# EAGLE schematic pcie-host (EAGLE 8.3.2)
DESIGNER: JON NEWMAN, JACK ZHANG; DESIGN_NAME: PCIE HOST BOARD; LICENSE: CC-BY-SA-4.0; REVISION: 1.1
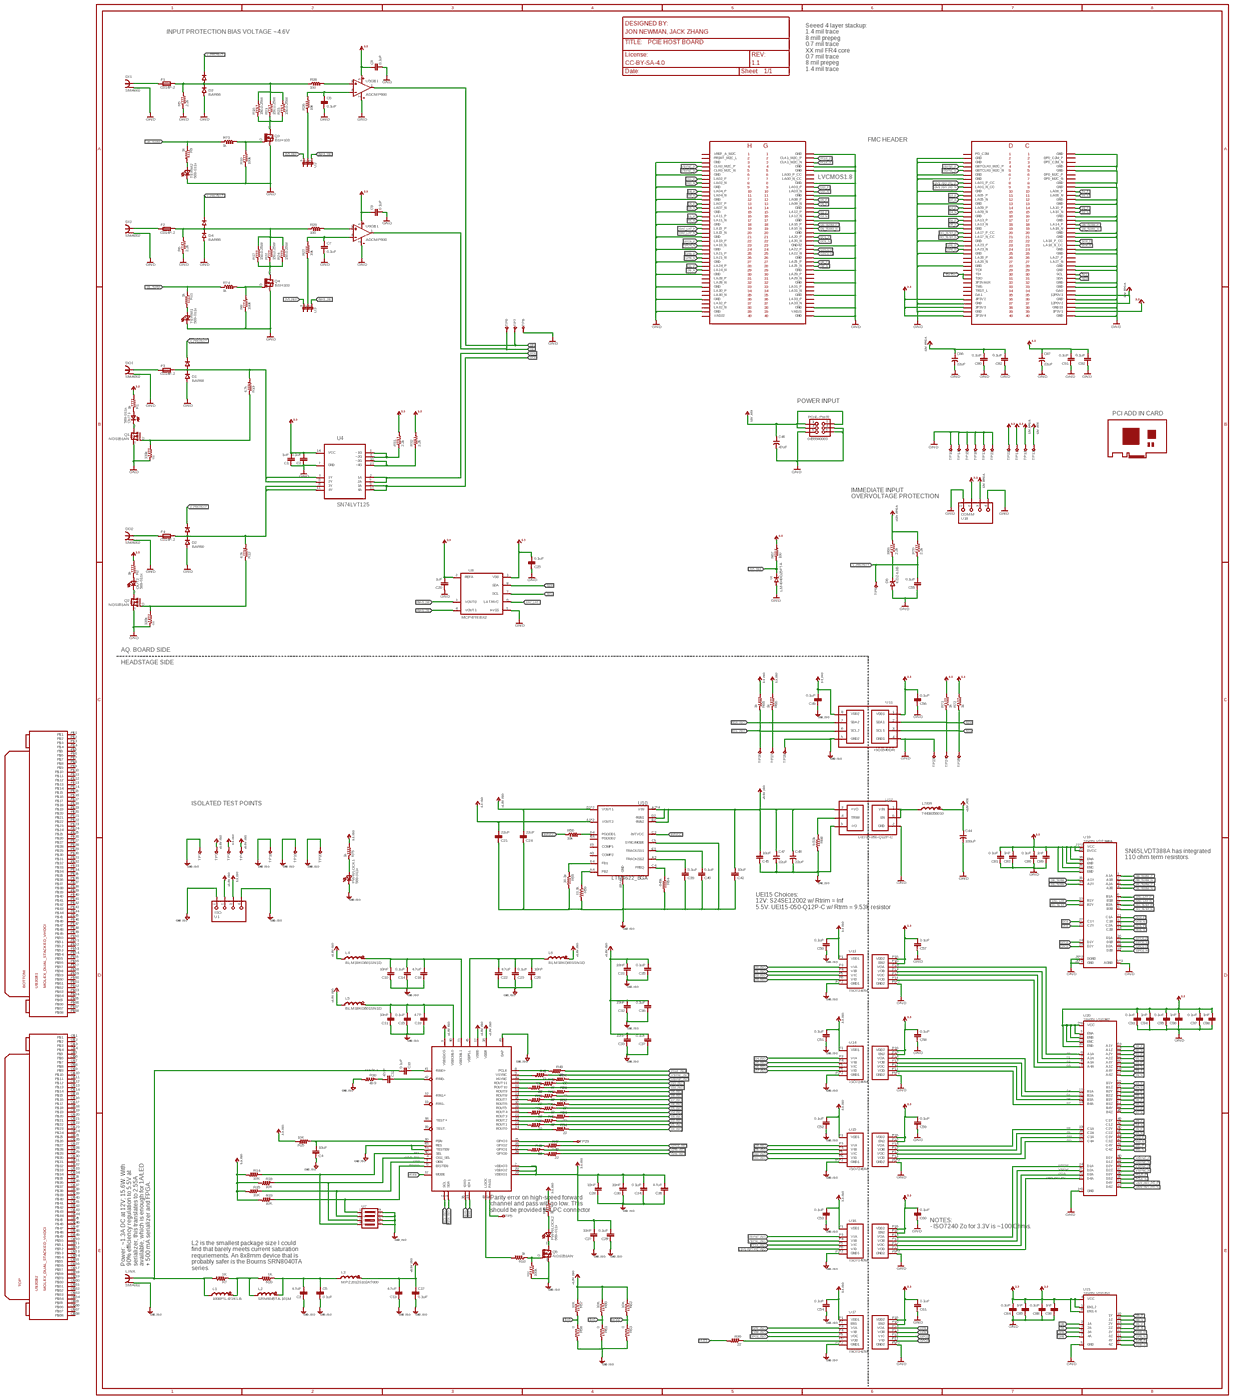
[diagram p0: schematic, sheet 1, overview]
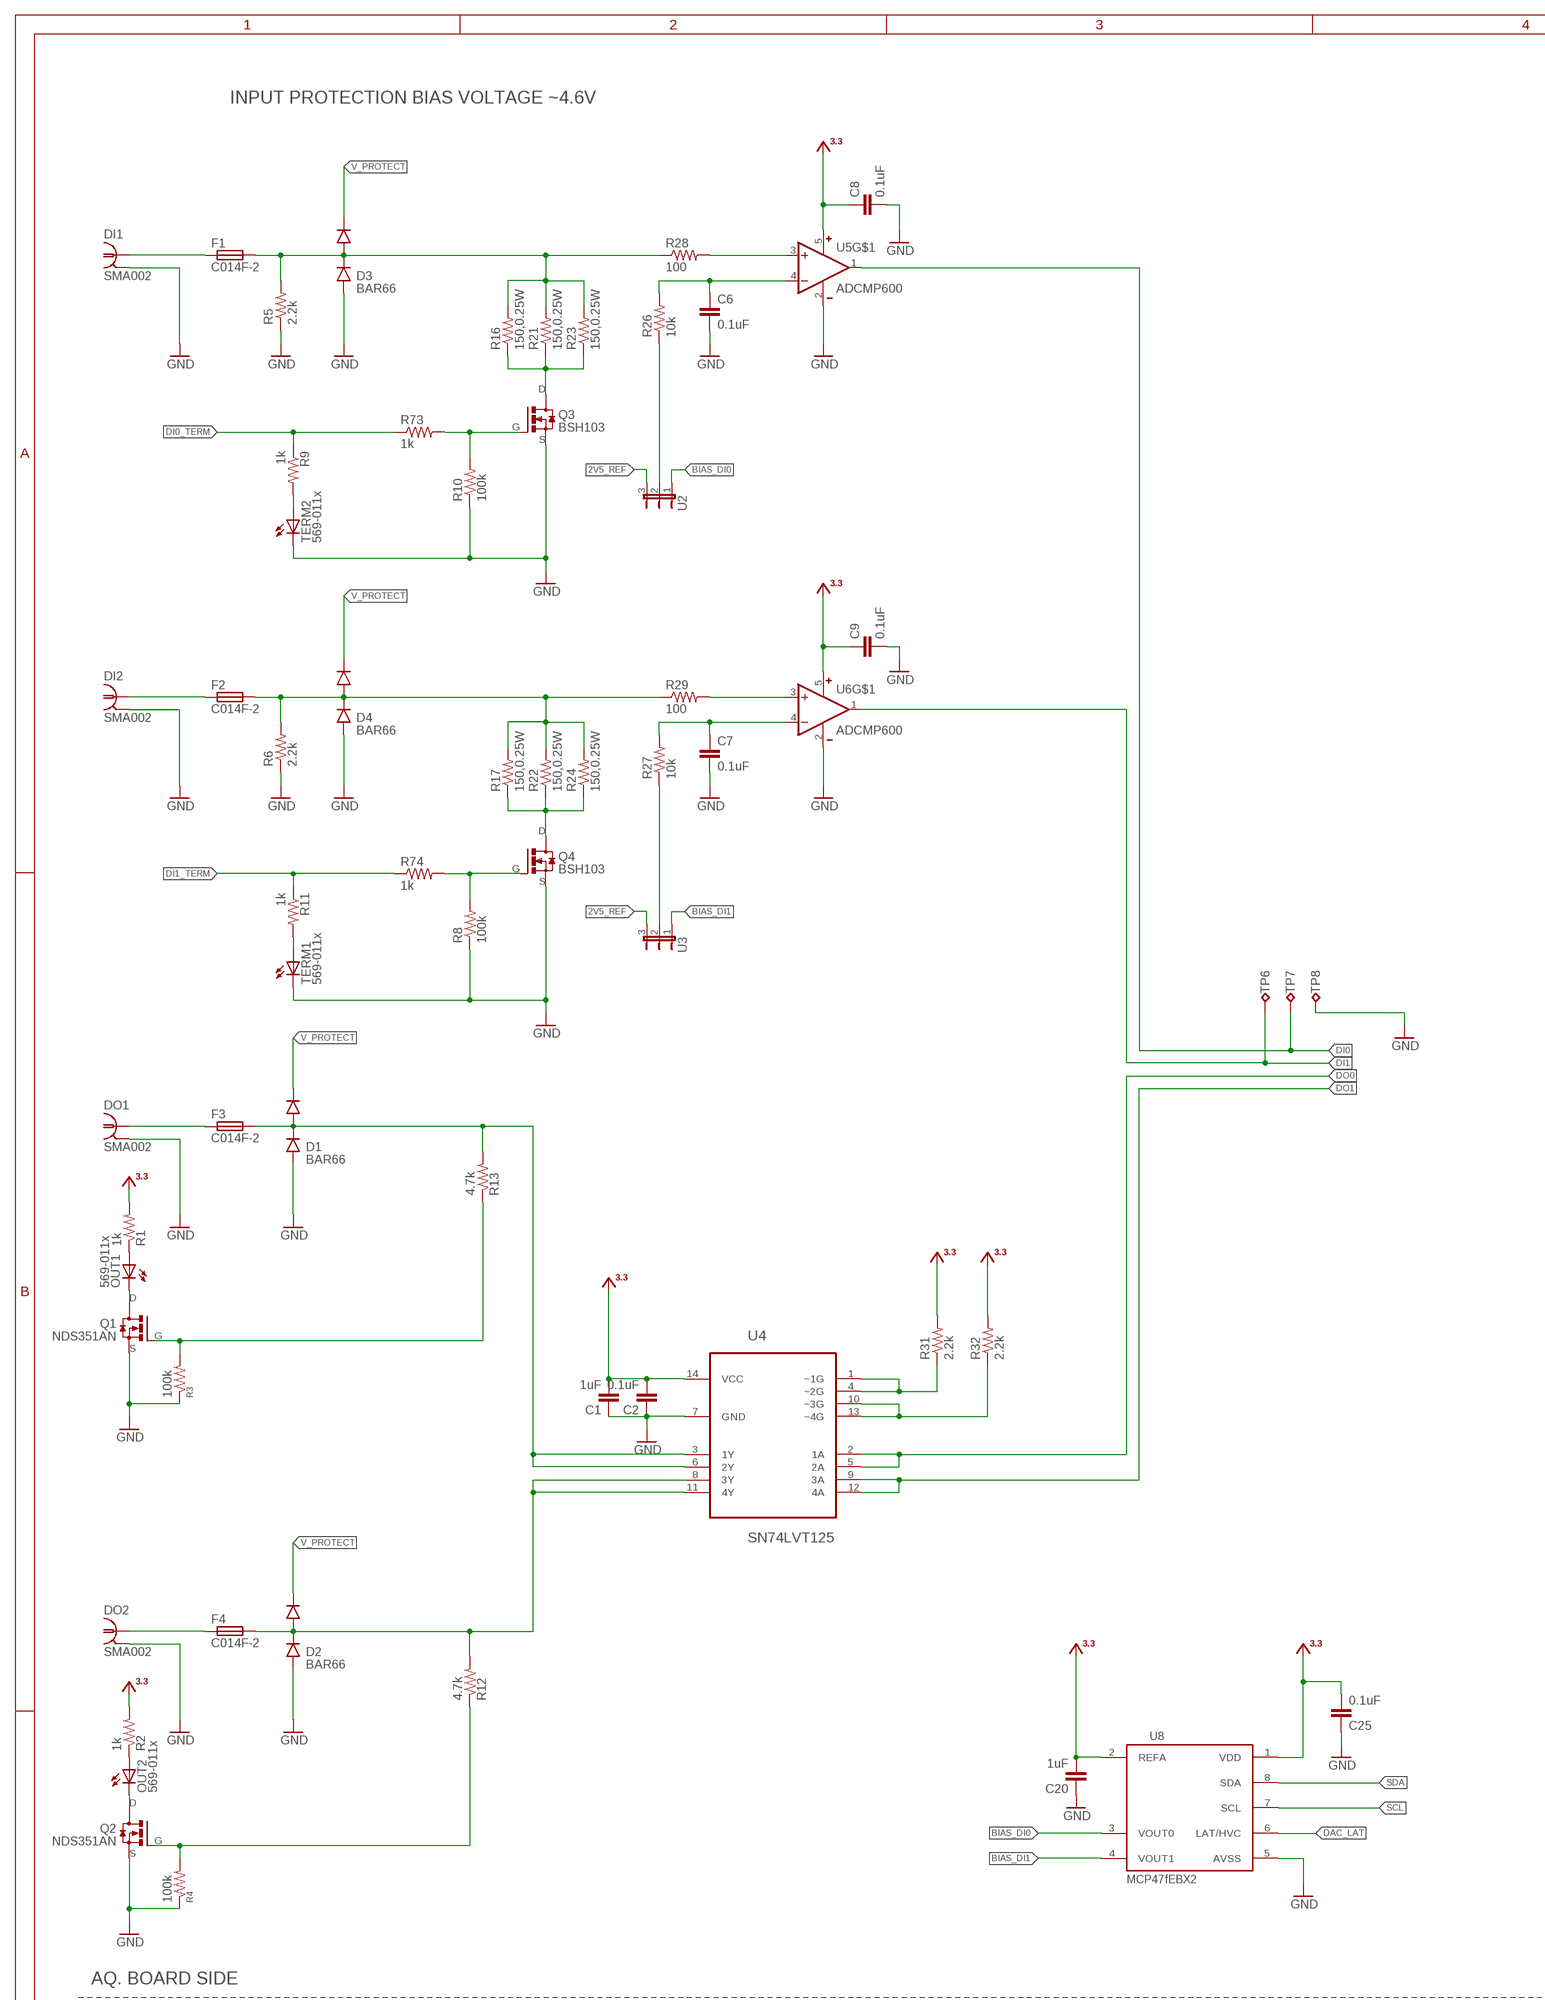
[diagram p1: schematic, sheet 1, part 1 of 4]
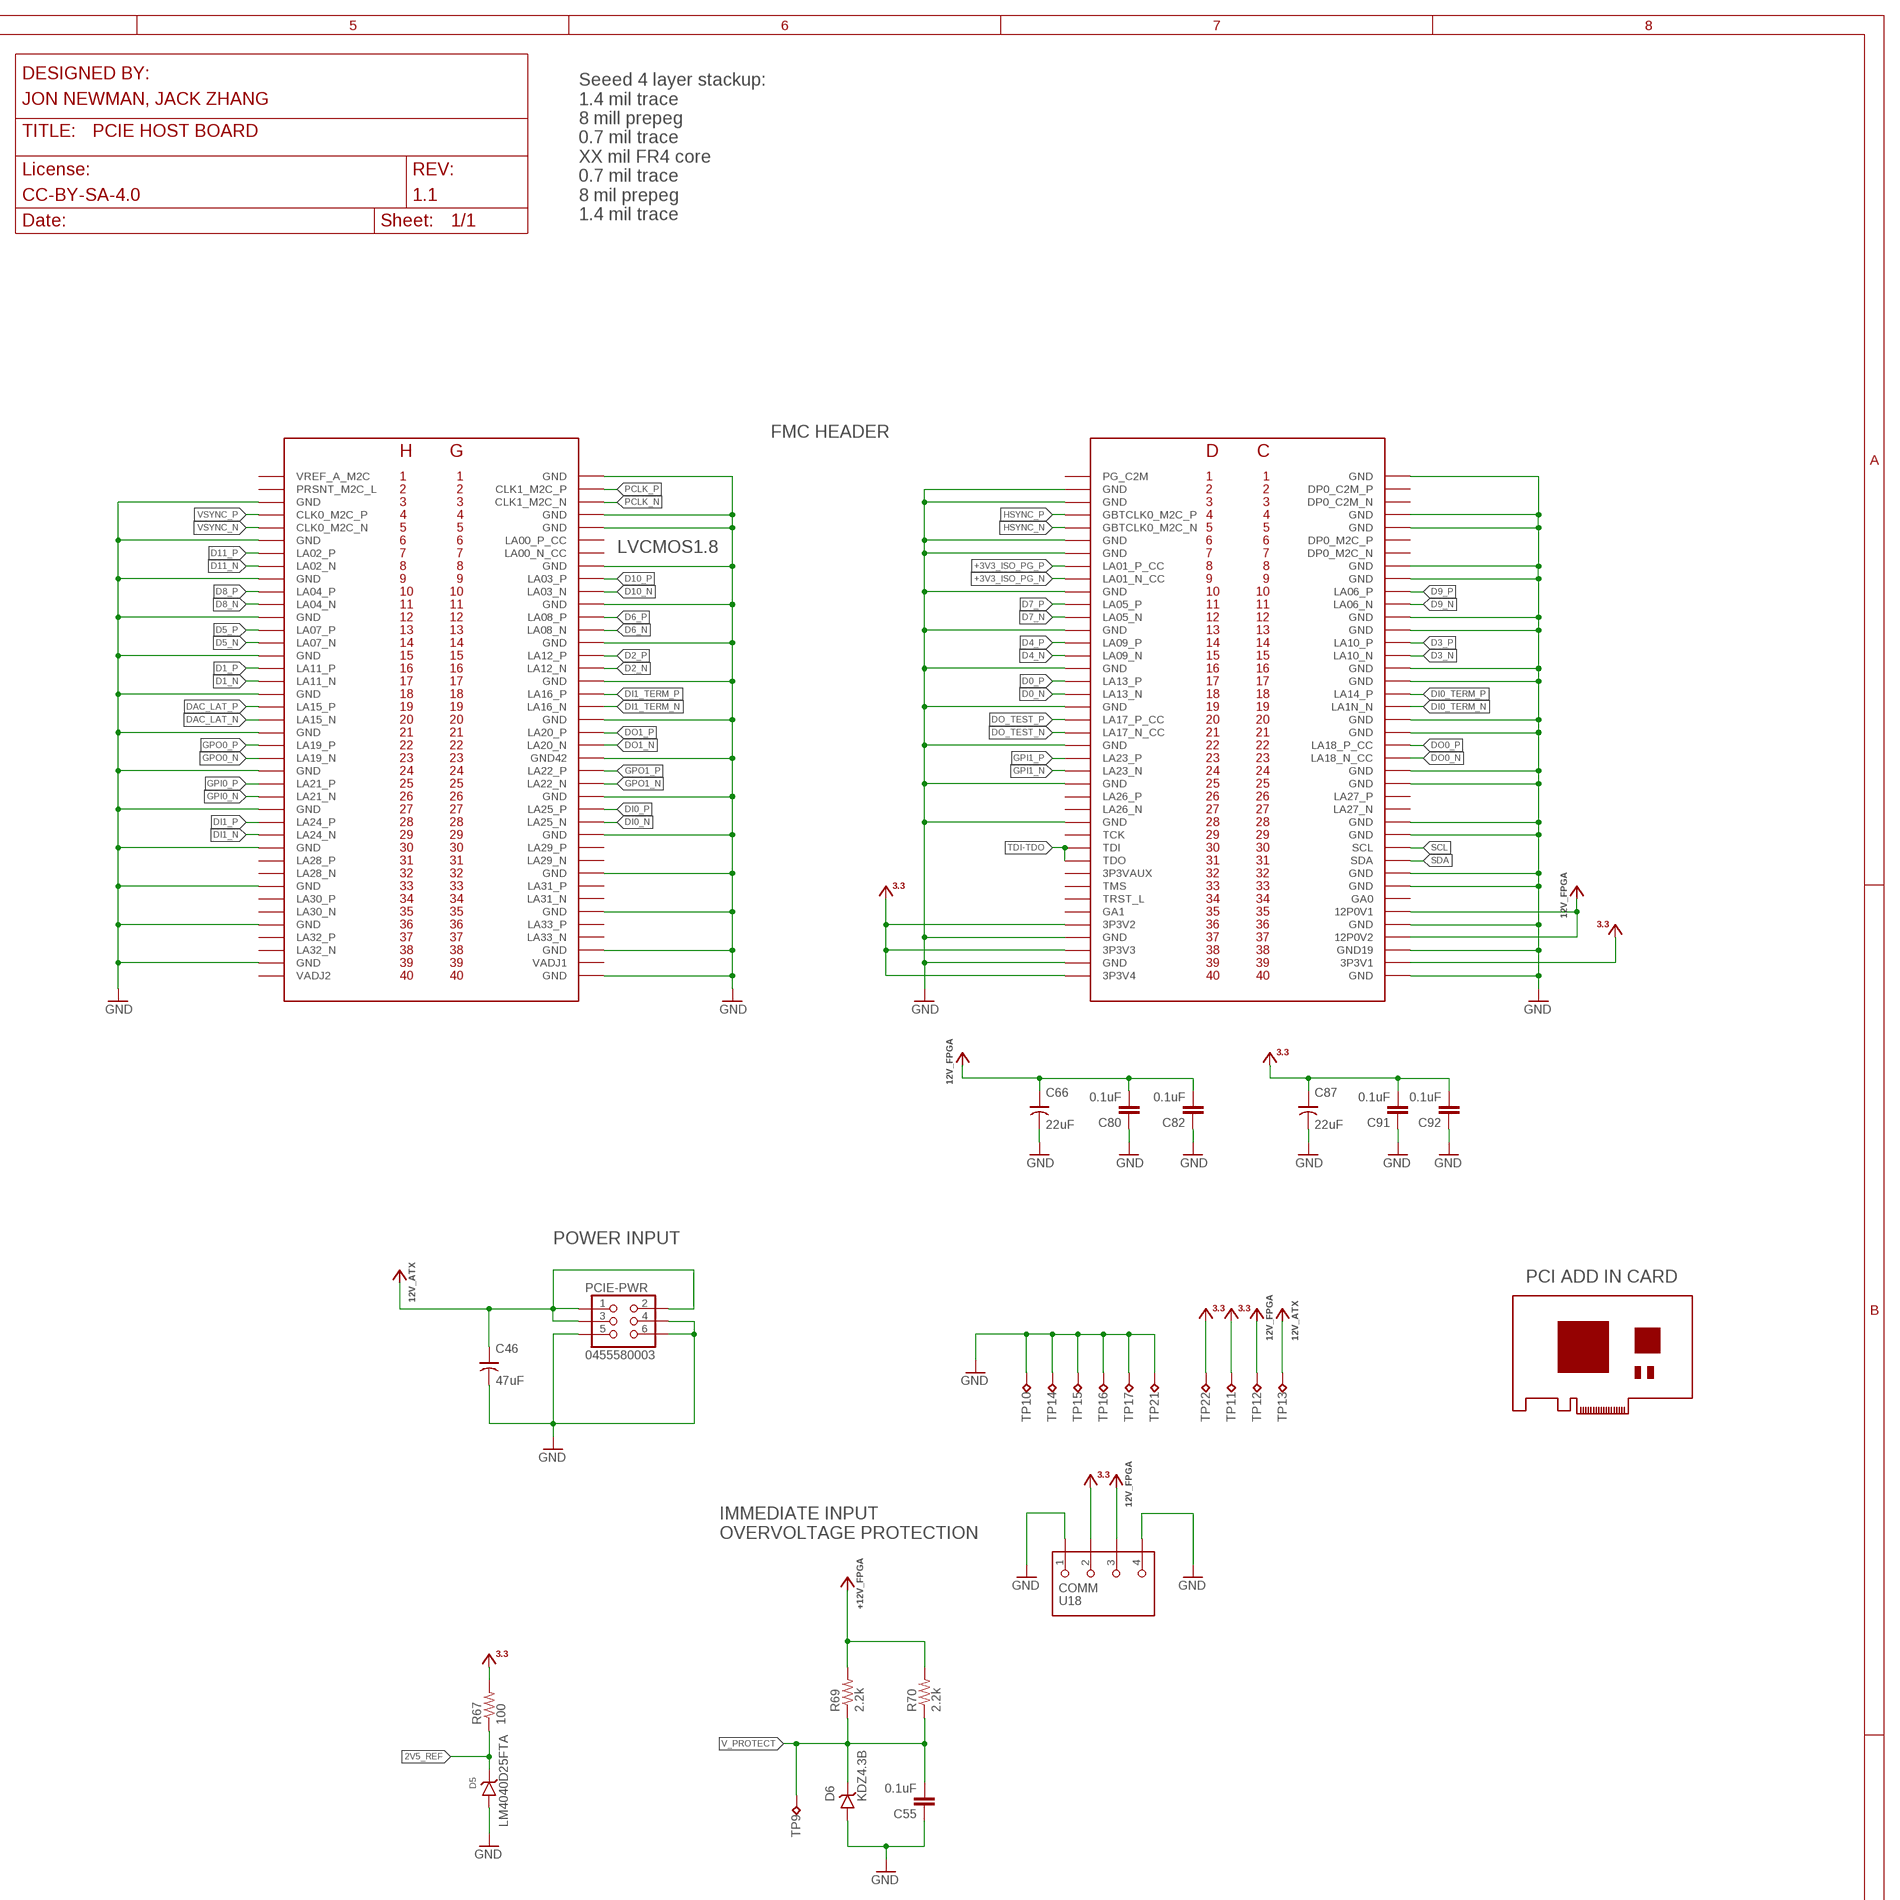
[diagram p2: schematic, sheet 1, part 2 of 4]
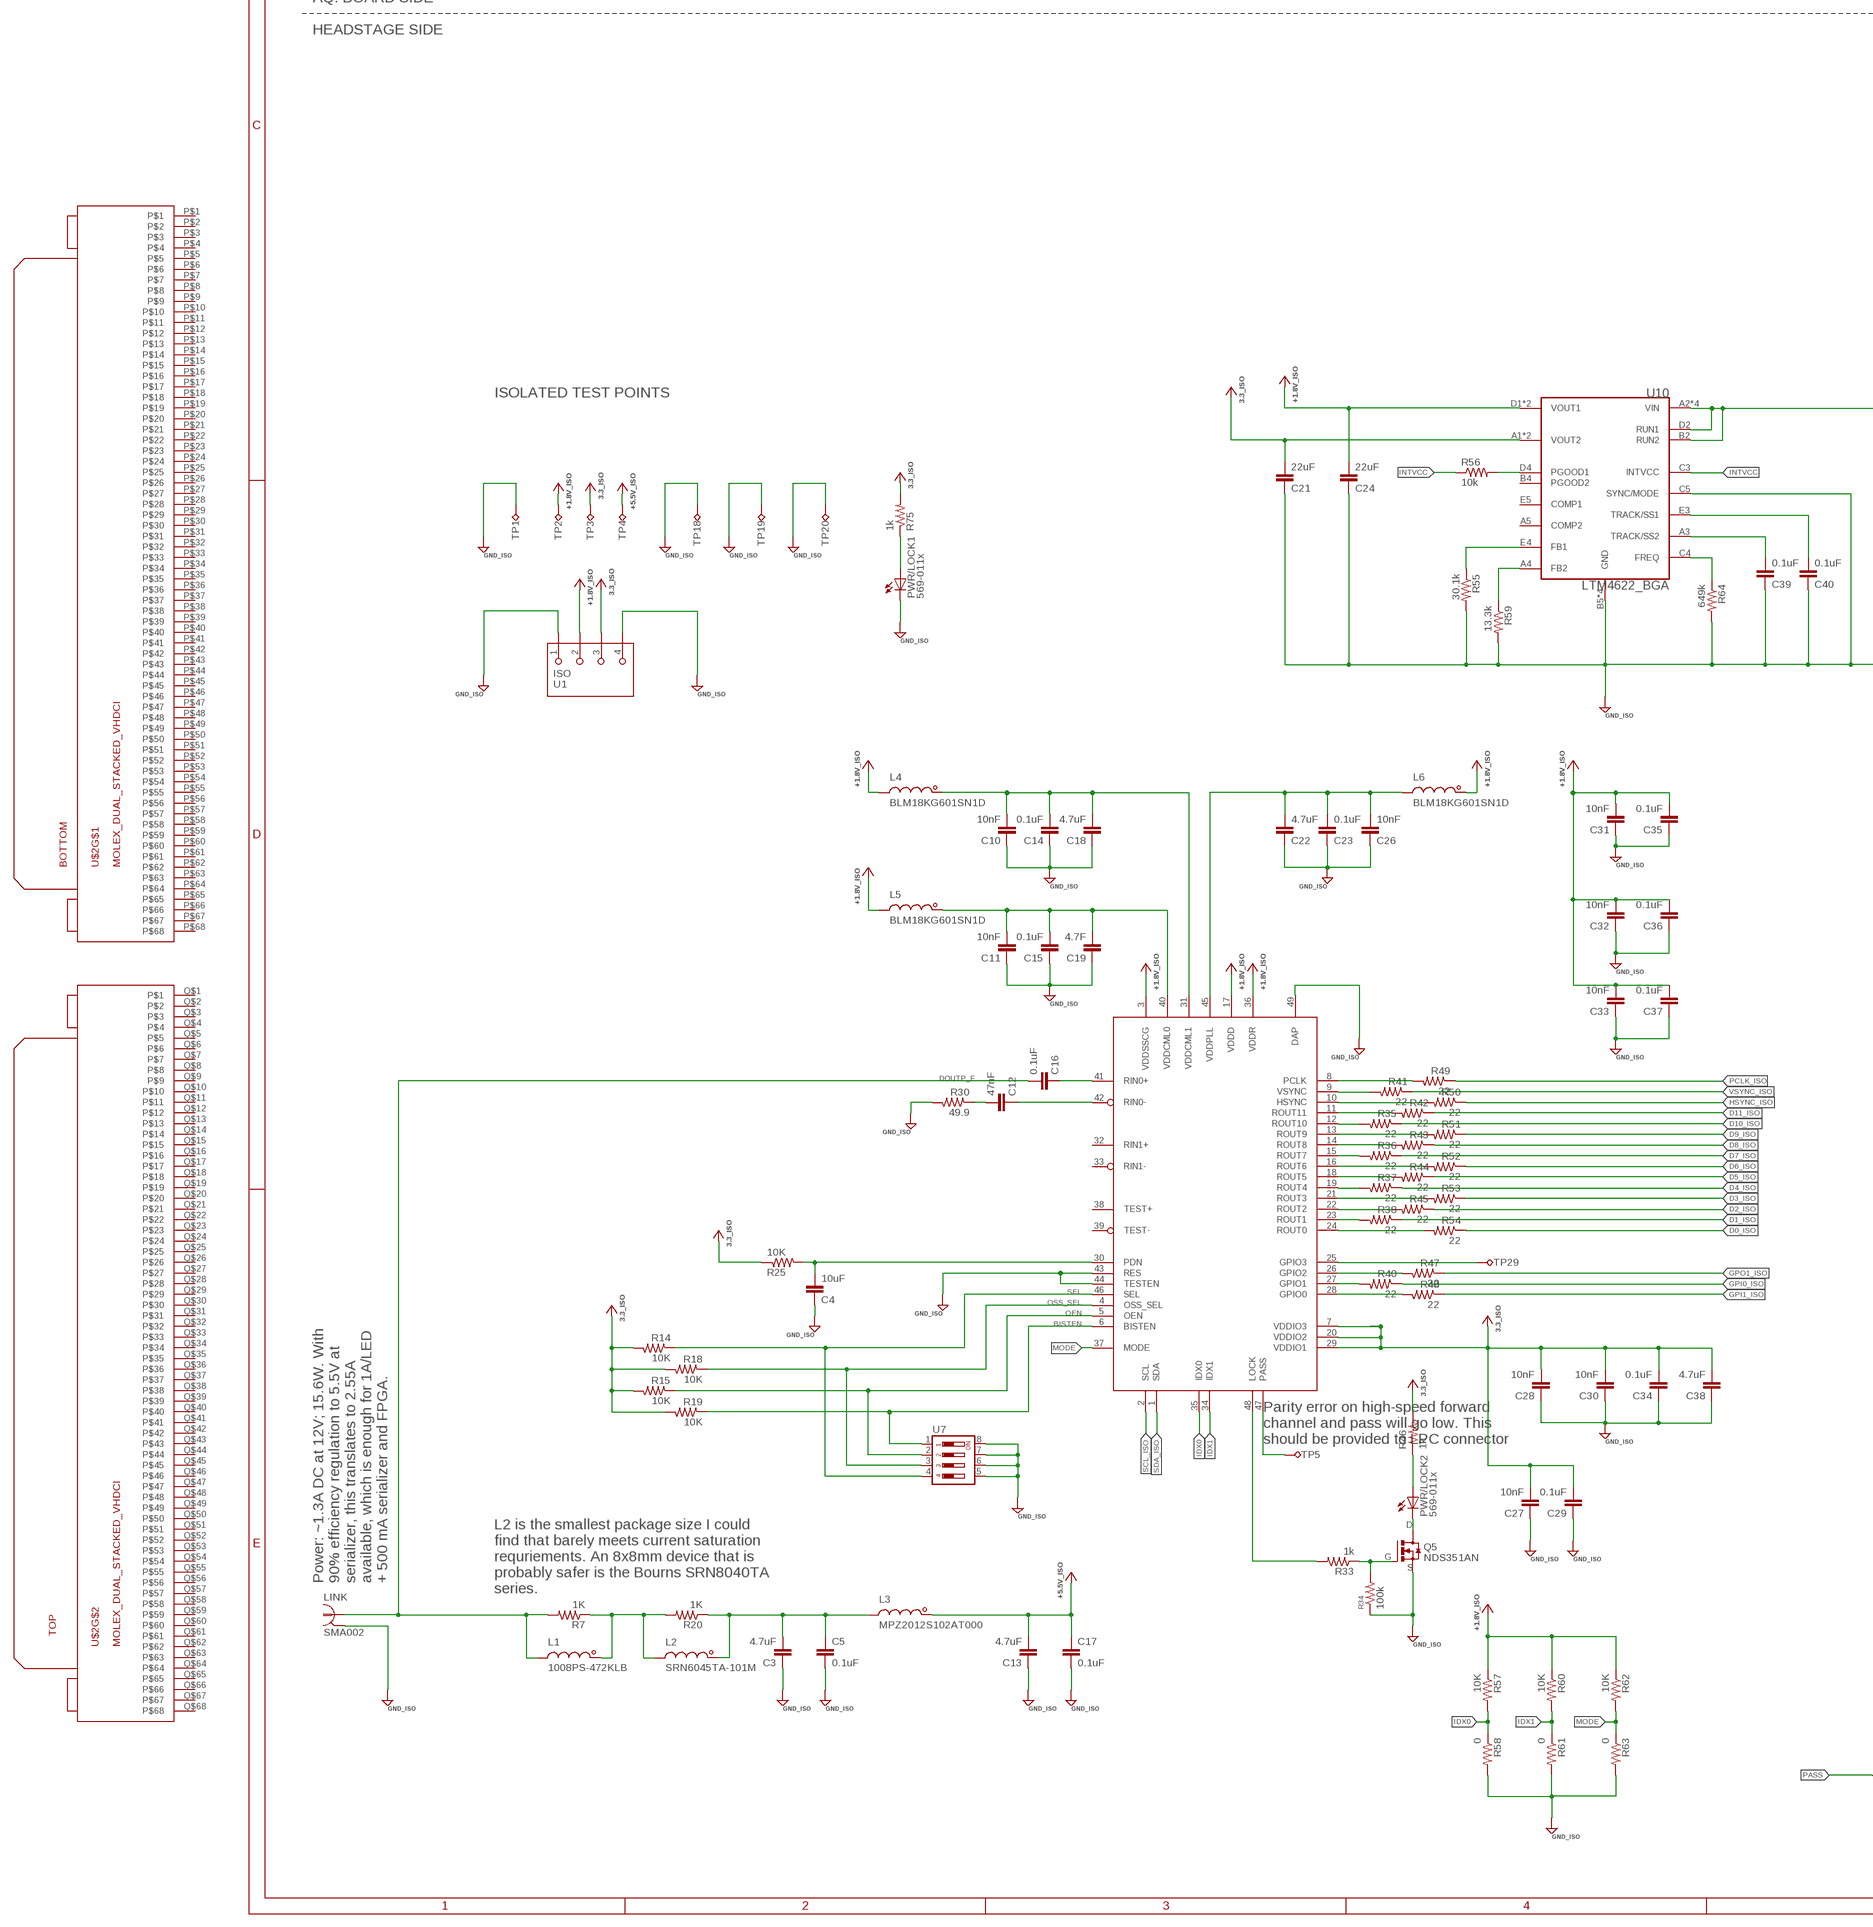
[diagram p3: schematic, sheet 1, part 3 of 4]
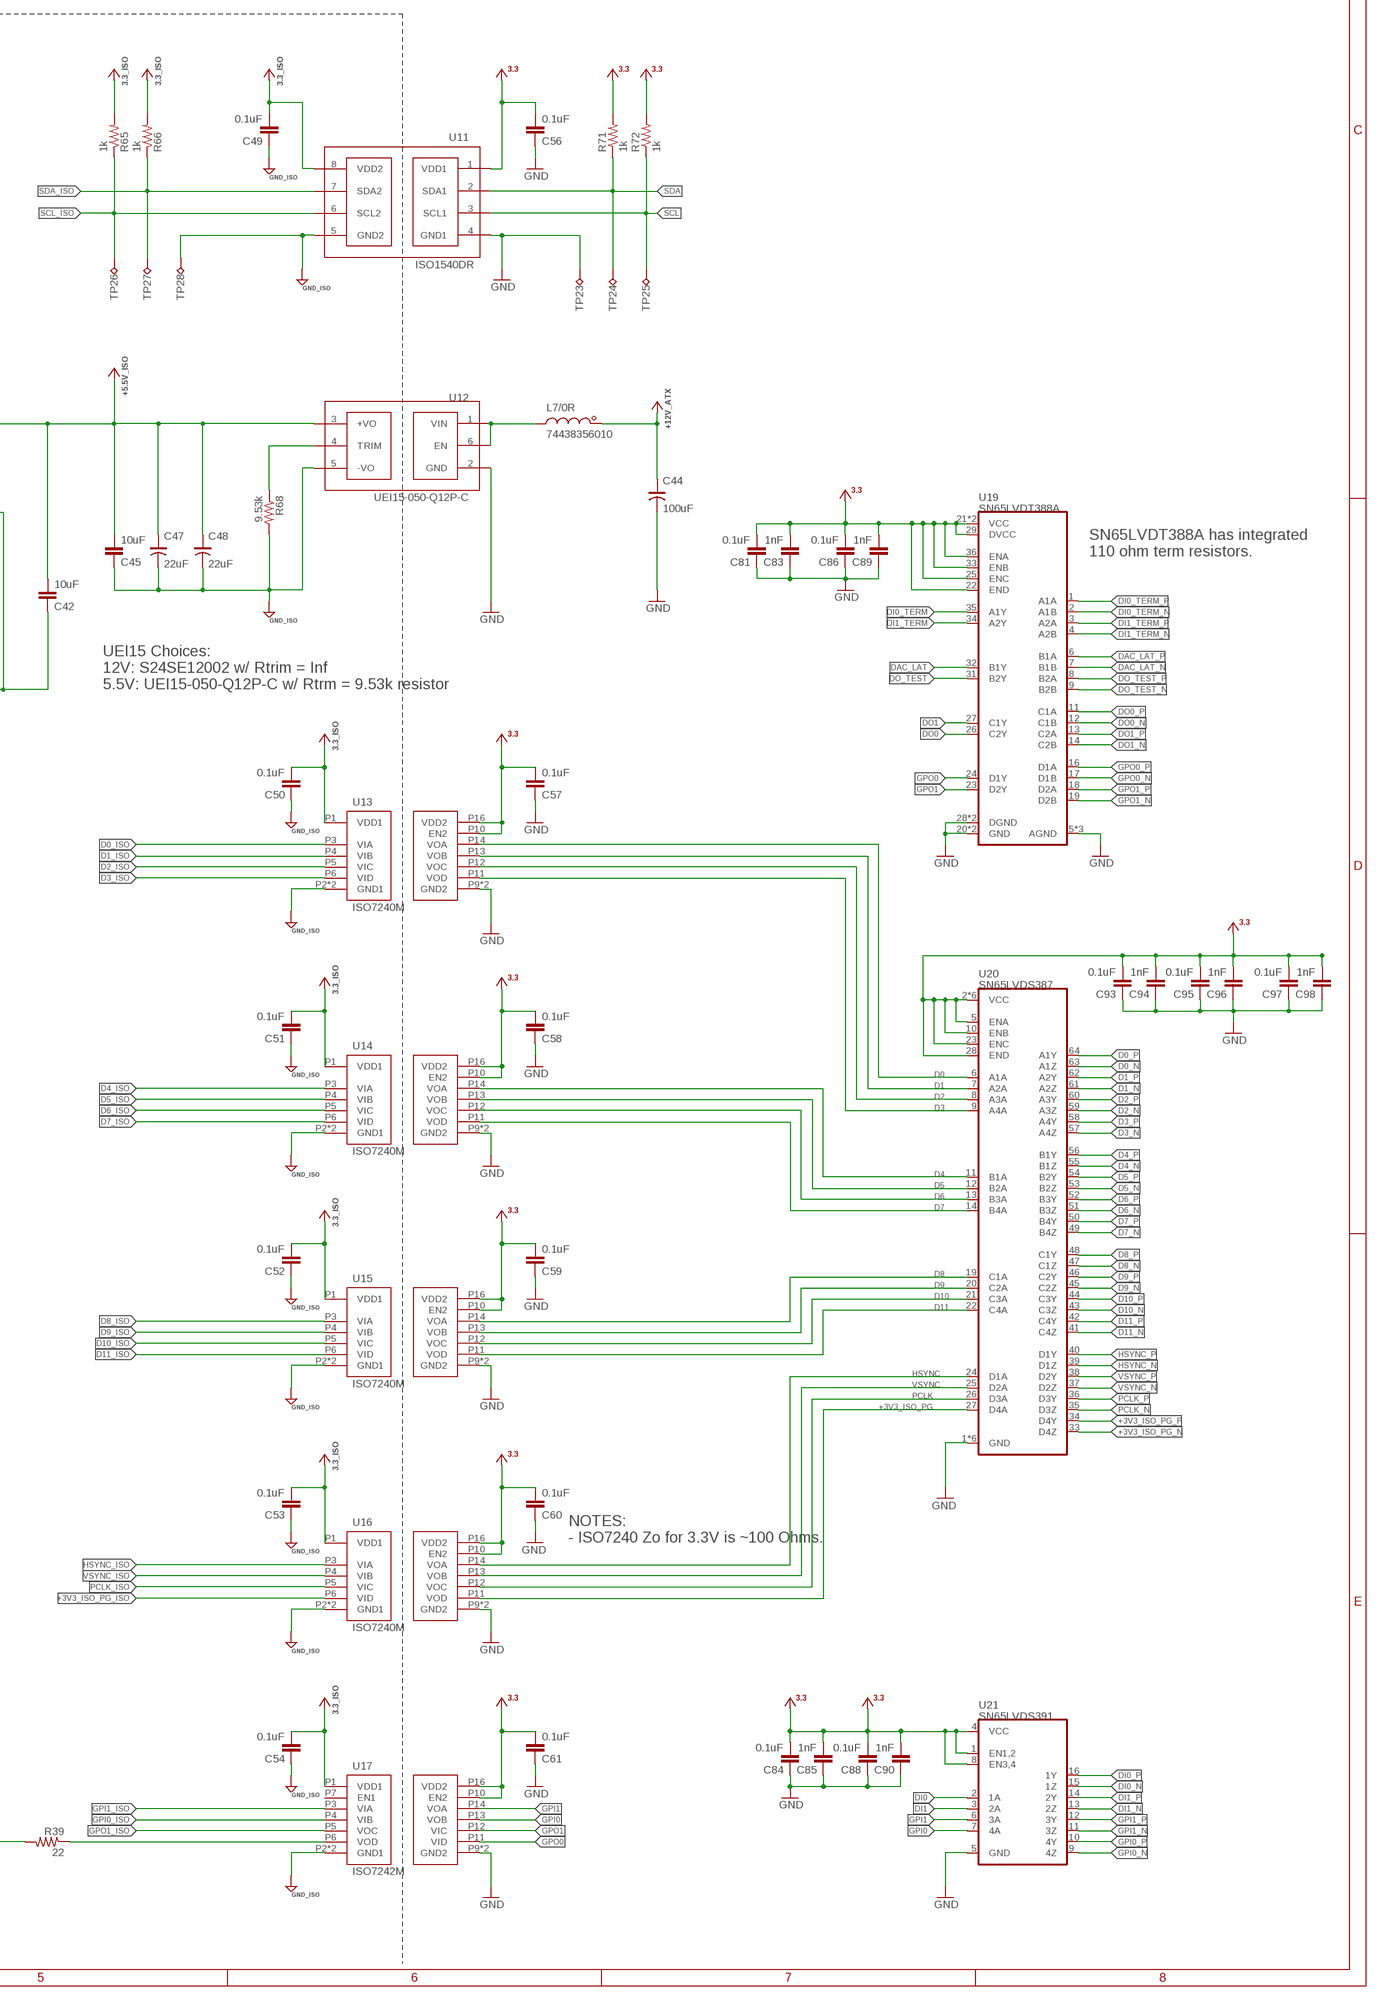
[diagram p4: schematic, sheet 1, part 4 of 4]

## Parts
C1  1uF  C_0603  [0603]
C2  0.1uF  C_0603  [0603]
C3  4.7uF  C_0805  [0805]
C4  10uF  C_0603  [0603]
C5  0.1uF  C_0603  [0603]
C6  0.1uF  C_0603  [0603]
C7  0.1uF  C_0603  [0603]
C8  0.1uF  C_0603  [0603]
C9  0.1uF  C_0603  [0603]
C10  10nF  C_0402  [0402]
C11  10nF  C_0402  [0402]
C12  47nF  C_0402  [0402]
C13  4.7uF  C_0805  [0805]
C14  0.1uF  C_0402  [0402]
C15  0.1uF  C_0402  [0402]
C16  0.1uF  C_0402  [0402]
C17  0.1uF  C_0603  [0603]
C18  4.7uF  C_1206  [1206]
C19  4.7F  C_1206  [1206]
C20  1uF  C_0805  [0805]
C21  22uF  C_1206  [1206]
C22  4.7uF  C_1206  [1206]
C23  0.1uF  C_0402  [0402]
C24  22uF  C_1206  [1206]
C25  0.1uF  C_0603  [0603]
C26  10nF  C_0402  [0402]
C27  10nF  C_0402  [0402]
C28  10nF  C_0402  [0402]
C29  0.1uF  C_0402  [0402]
C30  10nF  C_0402  [0402]
C31  10nF  C_0402  [0402]
C32  10nF  C_0402  [0402]
C33  10nF  C_0402  [0402]
C34  0.1uF  C_0402  [0402]
C35  0.1uF  C_0402  [0402]
C36  0.1uF  C_0402  [0402]
C37  0.1uF  C_0402  [0402]
C38  4.7uF  C_1206  [1206]
C39  0.1uF  C_0603  [0603]
C40  0.1uF  C_0603  [0603]
C42  10uF  C_1206  [1206]
C44  100uF  C-POL_0807  [153CLV-0807]
C45  10uF  C_1206  [1206]
C46  47uF  C-POL_0807  [153CLV-0807]
C47  22uF  C-POL_1210  [1210-POL]
C48  22uF  C-POL_1210  [1210-POL]
C49  0.1uF  C_0603  [0603]
C50  0.1uF  C_0603  [0603]
C51  0.1uF  C_0603  [0603]
C52  0.1uF  C_0603  [0603]
C53  0.1uF  C_0603  [0603]
C54  0.1uF  C_0603  [0603]
C55  0.1uF  C_0603  [0603]
C56  0.1uF  C_0603  [0603]
C57  0.1uF  C_0603  [0603]
C58  0.1uF  C_0603  [0603]
C59  0.1uF  C_0603  [0603]
C60  0.1uF  C_0603  [0603]
C61  0.1uF  C_0603  [0603]
C66  22uF  C-POL_1210  [1210-POL]
C80  0.1uF  C_0603  [0603]
C81  0.1uF  C_0603  [0603]
C82  0.1uF  C_0603  [0603]
C83  1nF  C_0402  [0402]
C84  0.1uF  C_0603  [0603]
C85  1nF  C_0402  [0402]
C86  0.1uF  C_0603  [0603]
C87  22uF  C-POL_1210  [1210-POL]
C88  0.1uF  C_0603  [0603]
C89  1nF  C_0402  [0402]
C90  1nF  C_0402  [0402]
C91  0.1uF  C_0603  [0603]
C92  0.1uF  C_0603  [0603]
C93  0.1uF  C_0603  [0603]
C94  1nF  C_0402  [0402]
C95  0.1uF  C_0603  [0603]
C96  1nF  C_0402  [0402]
C97  0.1uF  C_0603  [0603]
C98  1nF  C_0402  [0402]
D1  BAR66  DIODE2_SOT23  [SOT23]
D2  BAR66  DIODE2_SOT23  [SOT23]
D3  BAR66  DIODE2_SOT23  [SOT23]
D4  BAR66  DIODE2_SOT23  [SOT23]
D5  LM4040D25FTA  Z-DIODE_SOT23  [SOT23]
D6  KDZ4.3B  Z-DIODE_SOD123  [SOD123]
DI1  SMA002  COAX_CONREVSMA002-G  [SMA_JACK_CONREVSMA002-G]
DI2  SMA002  COAX_CONREVSMA002-G  [SMA_JACK_CONREVSMA002-G]
DO1  SMA002  COAX_CONREVSMA002-G  [SMA_JACK_CONREVSMA002-G]
DO2  SMA002  COAX_CONREVSMA002-G  [SMA_JACK_CONREVSMA002-G]
F1  C014F-2  FUSE_1812  [1812]
F2  C014F-2  FUSE_1812  [1812]
F3  C014F-2  FUSE_1812  [1812]
F4  C014F-2  FUSE_1812  [1812]
FMC_LPC  FMC_LPC_160_PIN  [FMC_LPC_MALE_WITH_SP601_BSILK]
L1  1008PS-472KLB  L_1008PS  [1008PS]
L2  SRN6045TA-101M  L_SRN6045TA  [SRN6045TA]
L3  MPZ2012S102AT000  L_0805  [0805]
L4  BLM18KG601SN1D  L_0603  [0603]
L5  BLM18KG601SN1D  L_0603  [0603]
L6  BLM18KG601SN1D  L_0603  [0603]
L7/0R  74438356010  L_4020  [4020]
LINK  SMA002  COAX_CONREVSMA002-G  [SMA_JACK_CONREVSMA002-G]
OUT  569-011x  LED_2X_VERTICAL  [569-011X-X00_LED_ARRAY]
PCIE-PWR  0455580003  PINHD-2X3_PCIE-PWR  [PCIE-POWER-6PIN]
PWR/LOCK  569-011x  LED_2X_VERTICAL  [569-011X-X00_LED_ARRAY]
Q1  NDS351AN  N-MOSFET_SOT23-GSD  [SOT23-GSD]
Q2  NDS351AN  N-MOSFET_SOT23-GSD  [SOT23-GSD]
Q3  BSH103  N-MOSFET_SOT23-GSD  [SOT23-GSD]
Q4  BSH103  N-MOSFET_SOT23-GSD  [SOT23-GSD]
Q5  NDS351AN  N-MOSFET_SOT23-GSD  [SOT23-GSD]
R1  1k  R_0603  [0603]
R2  1k  R_0603  [0603]
R3  100k  R_0603  [0603]
R4  100k  R_0603  [0603]
R5  2.2k  R_0603  [0603]
R6  2.2k  R_0603  [0603]
R7  1K  R_0603  [0603]
R8  100k  R_0603  [0603]
R9  1k  R_0603  [0603]
R10  100k  R_0603  [0603]
R11  1k  R_0603  [0603]
R12  4.7k  R_0603  [0603]
R13  4.7k  R_0603  [0603]
R14  10K  R_0402  [0402]
R15  10K  R_0402  [0402]
R16  150,0.25W  R_1206  [1206]
R17  150,0.25W  R_1206  [1206]
R18  10K  R_0402  [0402]
R19  10K  R_0402  [0402]
R20  1K  R_0603  [0603]
R21  150,0.25W  R_1206  [1206]
R22  150,0.25W  R_1206  [1206]
R23  150,0.25W  R_1206  [1206]
R24  150,0.25W  R_1206  [1206]
R25  10K  R_0402  [0402]
R26  10k  R_0603  [0603]
R27  10k  R_0603  [0603]
R28  100  R_0603  [0603]
R29  100  R_0603  [0603]
R30  49.9  R_0402  [0402]
R31  2.2k  R_0603  [0603]
R32  2.2k  R_0603  [0603]
R33  1k  R_0603  [0603]
R34  100k  R_0603  [0603]
R35  22  R_0402  [0402]
R36  22  R_0402  [0402]
R37  22  R_0402  [0402]
R38  22  R_0402  [0402]
R39  22  R_0402  [0402]
R40  22  R_0402  [0402]
R41  22  R_0402  [0402]
R42  22  R_0402  [0402]
R43  22  R_0402  [0402]
R44  22  R_0402  [0402]
R45  22  R_0402  [0402]
R46  1k  R_0603  [0603]
R47  22  R_0402  [0402]
R48  22  R_0402  [0402]
R49  22  R_0402  [0402]
R50  22  R_0402  [0402]
R51  22  R_0402  [0402]
R52  22  R_0402  [0402]
R53  22  R_0402  [0402]
R54  22  R_0402  [0402]
R55  30.1k  R_0603  [0603]
R56  10k  R_0603  [0603]
R57  10K  R_0402  [0402]
R58  0  R_0402  [0402]
R59  13.3k  R_0603  [0603]
R60  10K  R_0402  [0402]
R61  0  R_0402  [0402]
R62  10K  R_0402  [0402]
R63  0  R_0402  [0402]
R64  649k  R_0603  [0603]
R65  1k  R_0603  [0603]
R66  1k  R_0603  [0603]
R67  100  R_0603  [0603]
R68  9.53k  R_0603  [0603]
R69  2.2k  R_0603  [0603]
R70  2.2k  R_0603  [0603]
R71  1k  R_0603  [0603]
R72  1k  R_0603  [0603]
R73  1k  R_0603  [0603]
R74  1k  R_0603  [0603]
R75  1k  R_0603  [0603]
TERM  569-011x  LED_2X_VERTICAL  [569-011X-X00_LED_ARRAY]
TP1  GND(ISO)  TP_1MM  [TESTPOINT_1MM]
TP2  +1.8V(ISO)  TP_1MM  [TESTPOINT_1MM]
TP3  +3.3V(ISO)  TP_2MM  [TESTPOINT_2MM]
TP4  +5.5V(ISO)  TP_2MM  [TESTPOINT_2MM]
TP5  PASS  TPTP06R  [TP06R]
TP6  DI1  TPTP09SQ  [TP09SQ]
TP7  DI0  TPTP09SQ  [TP09SQ]
TP8  GND  TP_0.035IN  [TESTPOINT_0.035IN]
TP9  VPROTECT(+4.3V)  TP_0.035IN  [TESTPOINT_0.035IN]
TP10  GND  TP_2MM  [TESTPOINT_2MM]
TP11  +3.3V  TP_2MM  [TESTPOINT_2MM]
TP12  +12V(FPGA)  TP_2MM  [TESTPOINT_2MM]
TP13  +12V(ATX)  TP_2MM  [TESTPOINT_2MM]
TP14  GND  TP_2MM  [TESTPOINT_2MM]
TP15  GND  TP_2MM  [TESTPOINT_2MM]
TP16  GND  TP_2MM  [TESTPOINT_2MM]
TP17  GND  TP_2MM  [TESTPOINT_2MM]
TP18  GND(ISO)  TP_1MM  [TESTPOINT_1MM]
TP19  GND(ISO)  TP_1MM  [TESTPOINT_1MM]
TP20  GND(ISO)  TP_1MM  [TESTPOINT_1MM]
TP21  GND  TP_2MM  [TESTPOINT_2MM]
TP22  +3.3V  TP_2MM  [TESTPOINT_2MM]
TP23  GND  TP_1MM  [TESTPOINT_1MM]
TP24  SDA  TP_1MM  [TESTPOINT_1MM]
TP25  SCL  TP_1MM  [TESTPOINT_1MM]
TP26  SCL(ISO)  TP_1MM  [TESTPOINT_1MM]
TP27  SDA(ISO)  TP_1MM  [TESTPOINT_1MM]
TP28  GND(ISO)  TP_1MM  [TESTPOINT_1MM]
TP29  GPIO3  TPTP06R  [TP06R]
U1  ISO  SCREW4  [SCREW4]
U2  JP3E  [JP3]
U3  JP3E  [JP3]
U4  SN74LVT125  QUAD-LINE-DRIVER_SOIC  [SO14]
U5  ADCMP600  COMPARITOR_ADCMP600  [SOT-23-5]
U6  ADCMP600  COMPARITOR_ADCMP600  [SOT-23-5]
U7  DIPSW-004_SMD-0.05IN  [DIP04-SMD]
U8  MCP47FEBX2  [TSSOP-8]
U9  DS90UB914A-Q1  [WQFN48]
U10  LTM4622_BGA  [BGA_5X5_625X625]
U11  ISO1540DR  DIGISO-I2C_SOIC  [SOIC127P500X400-8N]
U12  UEI15-050-Q12P-C  DC-DC-CONVERTER-ADJ_UEI15  [UEI15]
U13  ISO7240M  DIGISO-4-0  [SOIC_WIDE_16]
U14  ISO7240M  DIGISO-4-0  [SOIC_WIDE_16]
U15  ISO7240M  DIGISO-4-0  [SOIC_WIDE_16]
U16  ISO7240M  DIGISO-4-0  [SOIC_WIDE_16]
U17  ISO7242M  DIGISO-2-2  [SOIC_WIDE_16]
U18  COMM  SCREW4  [SCREW4]
U19  SN65LVDT388A  SN65LVDS388A  [TSSOP-38]
U20  SN65LVDS387  SN65LVDS387_TSSOP  [TSSOP-64]
U21  SN65LVDS391  [TSSOP-16]
U$2  MOLEX_DUAL_STACKED_VHDCI  [MOLEX_743370911_SD_DUAL_STACKED_VHDCI]
X1  PCI-MECH_STD-H_HALF-W_FMC-STRAIN  [PCI-ADDIN_STD-H_HALF-L_FMC-STRAIN]

## Nets
2V5_REF: D5.1(C) R67.1 U2.3 U3.3
$N1: D4.3(COMM) F2.2 R6.2 R17.2 R22.2 R24.2 R29.1
$N2: D2.3(COMM) F4.2 R12.2 U4.8(3Y) U4.11(4Y)
$N3: D3.3(COMM) F1.2 R5.2 R16.2 R21.2 R23.2 R28.1
$N101: D1.3(COMM) F3.2 R13.2 U4.3(1Y) U4.6(2Y)
+1V8_ISO: C24.2 C31.2 C32.2 C33.2 C35.2 C36.2 C37.2 L4.2 L5.2 L6.1 R57.1 R60.1 R62.1 TP2.1(TP) U1.2 U9.3(VDDSSCG) U9.17(VDDD) U9.36(VDDR) U10.D1(VOUT1) U10.E1(VOUT1)
+3V3: C1.2 C2.2 C8.1 C9.1 C20.2 C25.2 C56.2 C57.2 C58.2 C59.2 C60.2 C61.2 C81.2 C83.2 C84.2 C85.2 C86.2 C87.+ C88.2 C89.2 C90.2 C91.2 C92.2 C93.2 C94.2 C95.2 C96.2 C97.2 C98.2 FMC_LPC.P$116(3P3V2) FMC_LPC.P$118(3P3V3) FMC_LPC.P$120(3P3V4) FMC_LPC.P$159(3P3V1) R1.2 R2.2 R31.2 R32.2 R67.2 R71.2 R72.2 TP11.1(TP) TP22.1(TP) U4.14(VCC) U5.5(V+) U6.5(V+) U8.1(VDD) U8.2(REFA) U11.1(VDD1) U13.P10(EN2) U13.P16(VDD2) U14.P10(EN2) U14.P16(VDD2) U15.P10(EN2) U15.P16(VDD2) U16.P10(EN2) U16.P16(VDD2) U17.P10(EN2) U17.P16(VDD2) U18.2 U19.21(VCC) U19.22(END) U19.25(ENC) U19.29(DVCC) U19.33(ENB) U19.36(ENA) U19.37(VCC) U20.2(VCC) U20.3(VCC) U20.5(ENA) U20.10(ENB) U20.16(VCC) U20.17(VCC) U20.23(ENC) U20.28(END) U20.30(VCC) U20.31(VCC) U21.1(EN1,2) U21.4(VCC) U21.8(EN3,4)
+3V3_ISO: C21.2 C27.2 C28.2 C29.2 C30.2 C34.2 C38.2 C49.2 C50.2 C51.2 C52.2 C53.2 C54.2 R14.2 R15.2 R18.2 R19.2 R25.1 R46.2 R65.2 R66.2 R75.2 TP3.1(TP) U1.3 U9.7(VDDIO3) U9.20(VDDIO2) U9.29(VDDIO1) U10.A1(VOUT2) U10.B1(VOUT2) U11.8(VDD2) U13.P1(VDD1) U14.P1(VDD1) U15.P1(VDD1) U16.P1(VDD1) U17.P1(VDD1)
+3V3_ISO_PG: U16.P11(VOD) U20.27(D4A)
+3V3_ISO_PG_ISO: R56.2 U10.D4(PGOOD1) U16.P6(VID)
+3V3_ISO_PG_N [diff]: FMC_LPC.P$89(LA01_N_CC) U20.33(D4Z)
+3V3_ISO_PG_P [diff]: FMC_LPC.P$88(LA01_P_CC) U20.34(D4Y)
+5.5V_ISO: C13.2 C17.1 C42.2 C45.2 C47.+ C48.+ L3.1 TP4.1(TP) U10.A2(VIN) U10.B2(RUN2) U10.B3(VIN) U10.D2(RUN1) U10.D3(VIN) U10.E2(VIN) U12.3(+VO)
+12V_ATX: C44.+ C46.+ L7/0R.1 PCIE-PWR.1 PCIE-PWR.2 PCIE-PWR.3 TP13.1(TP)
+12V_FPGA: C66.+ C80.2 C82.2 FMC_LPC.P$155(12P0V1) FMC_LPC.P$157(12P0V2) R69.2 R70.2 TP12.1(TP) U18.3
BIAS_DI0: U2.1 U8.3(VOUT0)
BIAS_DI1: U3.1 U8.4(VOUT1)
BISTEN: R19.1 U7.1 U9.6(BISTEN)
D0: U13.P14(VOA) U20.6(A1A)
D0_ISO: R54.1 U13.P3(VIA)
D0_N [diff]: FMC_LPC.P$98(LA13_N) U20.63(A1Z)
D0_P [diff]: FMC_LPC.P$97(LA13_P) U20.64(A1Y)
D1: U13.P13(VOB) U20.7(A2A)
D1_ISO: R38.1 U13.P4(VIB)
D1_N [diff]: FMC_LPC.P$17(LA11_N) U20.61(A2Z)
D1_P [diff]: FMC_LPC.P$16(LA11_P) U20.62(A2Y)
D2: U13.P12(VOC) U20.8(A3A)
D2_ISO: R45.1 U13.P5(VIC)
D2_N [diff]: FMC_LPC.P$56(LA12_N) U20.59(A3Z)
D2_P [diff]: FMC_LPC.P$55(LA12_P) U20.60(A3Y)
D3: U13.P11(VOD) U20.9(A4A)
D3_ISO: R53.1 U13.P6(VID)
D3_N [diff]: FMC_LPC.P$135(LA10_N) U20.57(A4Z)
D3_P [diff]: FMC_LPC.P$134(LA10_P) U20.58(A4Y)
D4: U14.P14(VOA) U20.11(B1A)
D4_ISO: R37.1 U14.P3(VIA)
D4_N [diff]: FMC_LPC.P$95(LA09_N) U20.55(B1Z)
D4_P [diff]: FMC_LPC.P$94(LA09_P) U20.56(B1Y)
D5: U14.P13(VOB) U20.12(B2A)
D5_ISO: R44.1 U14.P4(VIB)
D5_N [diff]: FMC_LPC.P$14(LA07_N) U20.53(B2Z)
D5_P [diff]: FMC_LPC.P$13(LA07_P) U20.54(B2Y)
D6: U14.P12(VOC) U20.13(B3A)
D6_ISO: R52.1 U14.P5(VIC)
D6_N [diff]: FMC_LPC.P$53(LA08_N) U20.51(B3Z)
D6_P [diff]: FMC_LPC.P$52(LA08_P) U20.52(B3Y)
D7: U14.P11(VOD) U20.14(B4A)
D7_ISO: R36.1 U14.P6(VID)
D7_N [diff]: FMC_LPC.P$92(LA05_N) U20.49(B4Z)
D7_P [diff]: FMC_LPC.P$91(LA05_P) U20.50(B4Y)
D8: U15.P14(VOA) U20.19(C1A)
D8_ISO: R43.1 U15.P3(VIA)
D8_N [diff]: FMC_LPC.P$11(LA04_N) U20.47(C1Z)
D8_P [diff]: FMC_LPC.P$10(LA04_P) U20.48(C1Y)
D9: U15.P13(VOB) U20.20(C2A)
D9_ISO: R51.1 U15.P4(VIB)
D9_N [diff]: FMC_LPC.P$131(LA06_N) U20.45(C2Z)
D9_P [diff]: FMC_LPC.P$130(LA06_P) U20.46(C2Y)
D10: U15.P12(VOC) U20.21(C3A)
D10_ISO: R35.1 U15.P5(VIC)
D10_N [diff]: FMC_LPC.P$50(LA03_N) U20.43(C3Z)
D10_P [diff]: FMC_LPC.P$49(LA03_P) U20.44(C3Y)
D11: U15.P11(VOD) U20.22(C4A)
D11_ISO: R42.1 U15.P6(VID)
D11_N [diff]: FMC_LPC.P$8(LA02_N) U20.41(C4Z)
D11_P [diff]: FMC_LPC.P$7(LA02_P) U20.42(C4Y)
DAC_LAT: U8.6(LAT/HVC) U19.32(B1Y)
DAC_LAT_N [diff]: FMC_LPC.P$20(LA15_N) U19.7(B1B)
DAC_LAT_P [diff]: FMC_LPC.P$19(LA15_P) U19.6(B1A)
DI0: TP7.TP U5.1(OUT) U21.2(1A)
DI0_N [diff]: FMC_LPC.P$68(LA25_N) U21.15(1Z)
DI0_P [diff]: FMC_LPC.P$67(LA25_P) U21.16(1Y)
DI0_TERM: R9.1 R73.1 U19.35(A1Y)
DI0_TERM_N [diff]: FMC_LPC.P$139(LA1N_N) U19.2(A1B)
DI0_TERM_P [diff]: FMC_LPC.P$138(LA14_P) U19.1(A1A)
DI1: TP6.TP U6.1(OUT) U21.3(2A)
DI1_N [diff]: FMC_LPC.P$29(LA24_N) U21.13(2Z)
DI1_P [diff]: FMC_LPC.P$28(LA24_P) U21.14(2Y)
DI1_TERM: R11.1 R74.1 U19.34(A2Y)
DI1_TERM_N [diff]: FMC_LPC.P$59(LA16_N) U19.4(A2B)
DI1_TERM_P [diff]: FMC_LPC.P$58(LA16_P) U19.3(A2A)
DO0: U4.2(1A) U4.5(2A) U19.26(C2Y)
DO0_N [diff]: FMC_LPC.P$143(LA18_N_CC) U19.12(C1B)
DO0_P [diff]: FMC_LPC.P$142(LA18_P_CC) U19.11(C1A)
DO1: U4.9(3A) U4.12(4A) U19.27(C1Y)
DO1_N [diff]: FMC_LPC.P$62(LA20_N) U19.14(C2B)
DO1_P [diff]: FMC_LPC.P$61(LA20_P) U19.13(C2A)
DO_TEST: U19.31(B2Y)
DO_TEST_N [diff]: FMC_LPC.P$101(LA17_N_CC) U19.9(B2B)
DO_TEST_P [diff]: FMC_LPC.P$100(LA17_P_CC) U19.8(B2A)
DOUTP_F: C16.2 L1.2 LINK.CLK R7.2
GND: C1.1 C2.1 C6.2 C7.2 C8.2 C9.2 C20.1 C25.1 C44.- C46.- C55.1 C56.1 C57.1 C58.1 C59.1 C60.1 C61.1 C66.- C80.1 C81.1 C82.1 C83.1 C84.1 C85.1 C86.1 C87.- C88.1 C89.1 C90.1 C91.1 C92.1 C93.1 C94.1 C95.1 C96.1 C97.1 C98.1 D1.1(A) D2.1(A) D3.1(A) D4.1(A) D5.2(A) D6.A DI1.GND$1 DI1.GND$2 DI1.GND$3 DI1.GND$4 DI2.GND$1 DI2.GND$2 DI2.GND$3 DI2.GND$4 DO1.GND$1 DO1.GND$2 DO1.GND$3 DO1.GND$4 DO2.GND$1 DO2.GND$2 DO2.GND$3 DO2.GND$4 FMC_LPC.P$3(GND) FMC_LPC.P$6(GND) FMC_LPC.P$9(GND) FMC_LPC.P$12(GND) FMC_LPC.P$15(GND) FMC_LPC.P$18(GND) FMC_LPC.P$21(GND) FMC_LPC.P$24(GND) FMC_LPC.P$27(GND) FMC_LPC.P$30(GND) FMC_LPC.P$33(GND) FMC_LPC.P$36(GND) FMC_LPC.P$39(GND) FMC_LPC.P$41(GND) FMC_LPC.P$44(GND) FMC_LPC.P$45(GND) FMC_LPC.P$48(GND) FMC_LPC.P$51(GND) FMC_LPC.P$54(GND) FMC_LPC.P$57(GND) FMC_LPC.P$60(GND) FMC_LPC.P$63(GND42) FMC_LPC.P$66(GND) FMC_LPC.P$69(GND) FMC_LPC.P$72(GND) FMC_LPC.P$75(GND) FMC_LPC.P$78(GND) FMC_LPC.P$80(GND) FMC_LPC.P$82(GND) FMC_LPC.P$83(GND) FMC_LPC.P$86(GND) FMC_LPC.P$87(GND) FMC_LPC.P$90(GND) FMC_LPC.P$93(GND) FMC_LPC.P$96(GND) FMC_LPC.P$99(GND) FMC_LPC.P$102(GND) FMC_LPC.P$105(GND) FMC_LPC.P$108(GND) FMC_LPC.P$117(GND) FMC_LPC.P$119(GND) FMC_LPC.P$121(GND) FMC_LPC.P$124(GND) FMC_LPC.P$125(GND) FMC_LPC.P$128(GND) FMC_LPC.P$129(GND) FMC_LPC.P$132(GND) FMC_LPC.P$133(GND) FMC_LPC.P$136(GND) FMC_LPC.P$137(GND) FMC_LPC.P$140(GND) FMC_LPC.P$141(GND) FMC_LPC.P$144(GND) FMC_LPC.P$145(GND) FMC_LPC.P$148(GND) FMC_LPC.P$149(GND) FMC_LPC.P$152(GND) FMC_LPC.P$153(GND) FMC_LPC.P$156(GND) FMC_LPC.P$158(GND19) FMC_LPC.P$160(GND) PCIE-PWR.4 PCIE-PWR.5 PCIE-PWR.6 Q1.S Q2.S Q3.S Q4.S R3.1 R4.1 R5.1 R6.1 R8.1 R10.1 TERM.C1(1:C) TERM.C2(2:C) TP8.1(TP) TP10.1(TP) TP14.1(TP) TP15.1(TP) TP16.1(TP) TP17.1(TP) TP21.1(TP) TP23.1(TP) U4.7(GND) U5.2(V-) U6.2(V-) U8.5(AVSS) U11.4(GND1) U12.2(GND) U13.P9(GND2) U13.P15(GND2) U14.P9(GND2) U14.P15(GND2) U15.P9(GND2) U15.P15(GND2) U16.P9(GND2) U16.P15(GND2) U17.P9(GND2) U17.P15(GND2) U18.1 U18.4 U19.5(AGND) U19.10(AGND) U19.15(AGND) U19.20(GND) U19.28(DGND) U19.30(DGND) U19.38(GND) U20.1(GND) U20.4(GND) U20.15(GND) U20.18(GND) U20.29(GND) U20.32(GND) U21.5(GND)
GND_ISO: C3.1 C4.1 C5.2 C10.1 C11.1 C13.1 C14.1 C15.1 C17.2 C18.1 C19.1 C21.1 C22.1 C23.1 C24.1 C26.1 C27.1 C28.1 C29.1 C30.1 C31.1 C32.1 C33.1 C34.1 C35.1 C36.1 C37.1 C38.1 C39.1 C40.1 C42.1 C45.1 C47.- C48.- C49.1 C50.1 C51.1 C52.1 C53.1 C54.1 LINK.GND$1 LINK.GND$2 LINK.GND$3 LINK.GND$4 PWR/LOCK.C1(1:C) Q5.S R30.2 R34.1 R55.2 R58.2 R59.2 R61.2 R63.2 R64.2 R68.2 TP1.1(TP) TP18.1(TP) TP19.1(TP) TP20.1(TP) TP28.1(TP) U1.1 U1.4 U7.5 U7.6 U7.7 U7.8 U9.43(RES) U9.44(TESTEN) U9.49(DAP) U10.B5(GND) U10.C1(GND) U10.C2(GND) U10.C5(SYNC/MODE) U10.D5(GND) U11.5(GND2) U12.5(-VO) U13.P2(GND1) U13.P8(GND1) U14.P2(GND1) U14.P8(GND1) U15.P2(GND1) U15.P8(GND1) U16.P2(GND1) U16.P8(GND1) U17.P2(GND1) U17.P8(GND1)
GPI0: U17.P13(VOB) U21.7(4A)
GPI0_ISO: R40.1 U17.P4(VIB)
GPI0_N [diff]: FMC_LPC.P$26(LA21_N) U21.9(4Z)
GPI0_P [diff]: FMC_LPC.P$25(LA21_P) U21.10(4Y)
GPI1: U17.P14(VOA) U21.6(3A)
GPI1_ISO: R48.1 U17.P3(VIA)
GPI1_N [diff]: FMC_LPC.P$104(LA23_N) U21.11(3Z)
GPI1_P [diff]: FMC_LPC.P$103(LA23_P) U21.12(3Y)
GPO0: U17.P11(VID) U19.24(D1Y)
GPO0_N [diff]: FMC_LPC.P$23(LA19_N) U19.17(D1B)
GPO0_P [diff]: FMC_LPC.P$22(LA19_P) U19.16(D1A)
GPO1: U17.P12(VIC) U19.23(D2Y)
GPO1_ISO: R47.1 U17.P5(VOC)
GPO1_N [diff]: FMC_LPC.P$65(LA22_N) U19.19(D2B)
GPO1_P [diff]: FMC_LPC.P$64(LA22_P) U19.18(D2A)
HSYNC: U16.P14(VOA) U20.24(D1A)
HSYNC_ISO: R50.1 U16.P3(VIA)
HSYNC_N [diff]: FMC_LPC.P$85(GBTCLK0_M2C_N) U20.39(D1Z)
HSYNC_P [diff]: FMC_LPC.P$84(GBTCLK0_M2C_P) U20.40(D1Y)
IDX0: R57.2 R58.1 U9.35(IDX0)
IDX1: R60.2 R61.1 U9.34(IDX1)
INTVCC: R56.1 U10.C3(INTVCC)
LOCK: R33.2 U9.48(LOCK)
MODE: R62.2 R63.1 U9.37(MODE)
N$1: R39.1 U17.P6(VOD)
N$2: Q3.D R16.1 R21.1 R23.1
N$3: R28.2 U5.3(+IN)
N$4: R49.2 U9.8(PCLK)
N$5: R59.1 U10.A4(FB2)
N$6: DI2.CLK F2.1
N$7: Q4.D R17.1 R22.1 R24.1
N$8: C39.2 U10.A3(TRACK/SS2)
N$9: R11.2 TERM.A1(1:A)
N$10: R55.1 U10.E4(FB1)
N$11: DI1.CLK F1.1
N$12: C40.2 U10.E3(TRACK/SS1)
N$13: R41.2 U9.9(VSYNC)
N$14: DO1.CLK F3.1
N$15: PWR/LOCK.A2(2:A) R46.1
N$16: R50.2 U9.10(HSYNC)
N$17: DO2.CLK F4.1
N$18: C6.1 R26.2 U5.4(-IN)
N$19: R29.2 U6.3(+IN)
N$20: C7.1 R27.2 U6.4(-IN)
N$21: L1.1 L2.2 R7.1 R20.2
N$22: C3.2 C5.1 L2.1 L3.2 R20.1
N$23: OUT.A1(1:A) R1.1
N$24: R31.1 U4.1(~1G) U4.4(~2G)
N$25: R32.1 U4.10(~3G) U4.13(~4G)
N$26: R68.1 U12.4(TRIM)
N$27: C16.1 U9.41(RIN0+)
N$28: C12.1 U9.42(RIN0-)
N$29: PWR/LOCK.C2(2:C) Q5.D
N$30: R9.2 TERM.A2(2:A)
N$31: OUT.A2(2:A) R2.1
N$32: C12.2 R30.1
N$33: PWR/LOCK.A1(1:A) R75.1
N$34: Q4.G R8.2 R74.2
N$35: OUT.C1(1:C) Q1.D
N$36: R27.1 U3.2
N$37: Q3.G R10.2 R73.2
N$38: TP29.TP U9.25(GPIO3)
N$39: Q1.G R3.2 R13.1
N$44: R51.2 U9.13(ROUT9)
N$45: R43.2 U9.14(ROUT8)
N$46: R36.2 U9.15(ROUT7)
N$47: R52.2 U9.16(ROUT6)
N$48: R44.2 U9.18(ROUT5)
N$49: R37.2 U9.19(ROUT4)
N$50: R53.2 U9.21(ROUT3)
N$51: R45.2 U9.22(ROUT2)
N$52: R38.2 U9.23(ROUT1)
N$53: R54.2 U9.24(ROUT0)
N$54: R42.2 U9.11(ROUT11)
N$55: R35.2 U9.12(ROUT10)
N$57: R47.2 U9.26(GPIO2)
N$58: R40.2 U9.27(GPIO1)
N$59: R48.2 U9.28(GPIO0)
N$60: OUT.C2(2:C) Q2.D
N$61: Q2.G R4.2 R12.1
N$62: Q5.G R33.1 R34.2
N$136: R26.1 U2.2
N$145: R64.1 U10.C4(FREQ)
OEN: R15.1 U7.2 U9.5(OEN)
OSS_SEL: R18.1 U7.3 U9.4(OSS_SEL)
PASS: R39.2 TP5.TP U9.47(PASS)
PCLK: U16.P12(VOC) U20.26(D3A)
PCLK_ISO: R49.1 U16.P5(VIC)
PCLK_N [diff]: FMC_LPC.P$43(CLK1_M2C_N) U20.35(D3Z)
PCLK_P [diff]: FMC_LPC.P$42(CLK1_M2C_P) U20.36(D3Y)
PDN: C4.2 R25.2 U9.30(PDN)
SCL: FMC_LPC.P$150(SCL) R72.1 TP25.1(TP) U8.7(SCL) U11.3(SCL1)
SCL_ISO: R65.1 TP26.1(TP) U9.2(SCL) U11.6(SCL2)
SDA: FMC_LPC.P$151(SDA) R71.1 TP24.1(TP) U8.8(SDA) U11.2(SDA1)
SDA_ISO: R66.1 TP27.1(TP) U9.1(SDA) U11.7(SDA2)
SEL: R14.1 U7.4 U9.46(SEL)
TDI-TDO: FMC_LPC.P$110(TDI) FMC_LPC.P$111(TDO)
V_PROTECT: C55.2 D1.2(C) D2.2(C) D3.2(C) D4.2(C) D6.C R69.1 R70.1 TP9.1(TP)
VDDCML0: C11.2 C15.2 C19.2 L5.1 U9.40(VDDCML0)
VDDCML1: C10.2 C14.2 C18.2 L4.1 U9.31(VDDCML1)
VDDPLL: C22.2 C23.2 C26.2 L6.2 U9.45(VDDPLL)
VIN: L7/0R.2 U12.1(VIN) U12.6(EN)
VSYNC: U16.P13(VOB) U20.25(D2A)
VSYNC_ISO: R41.1 U16.P4(VIB)
VSYNC_N [diff]: FMC_LPC.P$5(CLK0_M2C_N) U20.37(D2Z)
VSYNC_P [diff]: FMC_LPC.P$4(CLK0_M2C_P) U20.38(D2Y)
Unconnected: FMC_LPC.P$1(VREF_A_M2C) FMC_LPC.P$2(PRSNT_M2C_L) FMC_LPC.P$31(LA28_P) FMC_LPC.P$32(LA28_N) FMC_LPC.P$34(LA30_P) FMC_LPC.P$35(LA30_N) FMC_LPC.P$37(LA32_P) FMC_LPC.P$38(LA32_N) FMC_LPC.P$40(VADJ2) FMC_LPC.P$46(LA00_P_CC) FMC_LPC.P$47(LA00_N_CC) FMC_LPC.P$70(LA29_P) FMC_LPC.P$71(LA29_N) FMC_LPC.P$73(LA31_P) FMC_LPC.P$74(LA31_N) FMC_LPC.P$76(LA33_P) FMC_LPC.P$77(LA33_N) FMC_LPC.P$79(VADJ1) FMC_LPC.P$81(PG_C2M) FMC_LPC.P$106(LA26_P) FMC_LPC.P$107(LA26_N) FMC_LPC.P$109(TCK) FMC_LPC.P$112(3P3VAUX) FMC_LPC.P$113(TMS) FMC_LPC.P$114(TRST_L) FMC_LPC.P$115(GA1) FMC_LPC.P$122(DP0_C2M_P) FMC_LPC.P$123(DP0_C2M_N) FMC_LPC.P$126(DP0_M2C_P) FMC_LPC.P$127(DP0_M2C_N) FMC_LPC.P$146(LA27_P) FMC_LPC.P$147(LA27_N) FMC_LPC.P$154(GA0) U9.32(RIN1+) U9.33(RIN1-) U9.38(TEST+) U9.39(TEST-) U10.A5(COMP2) U10.B4(PGOOD2) U10.E5(COMP1) U17.P7(EN1) U$2.P$1 U$2.P$2 U$2.P$3 U$2.P$4 U$2.P$5 U$2.P$6 U$2.P$7 U$2.P$8 U$2.P$9 U$2.P$10 U$2.P$11 U$2.P$12 U$2.P$13 U$2.P$14 U$2.P$15 U$2.P$16 U$2.P$17 U$2.P$18 U$2.P$19 U$2.P$20 U$2.P$21 U$2.P$22 U$2.P$23 U$2.P$24 U$2.P$25 U$2.P$26 U$2.P$27 U$2.P$28 U$2.P$29 U$2.P$30 U$2.P$31 U$2.P$32 U$2.P$33 U$2.P$34 U$2.P$35 U$2.P$36 U$2.P$37 U$2.P$38 U$2.P$39 U$2.P$40 U$2.P$41 U$2.P$42 U$2.P$43 U$2.P$44 U$2.P$45 U$2.P$46 U$2.P$47 U$2.P$48 U$2.P$49 U$2.P$50 U$2.P$51 U$2.P$52 U$2.P$53 U$2.P$54 U$2.P$55 U$2.P$56 U$2.P$57 U$2.P$58 U$2.P$59 U$2.P$60 U$2.P$61 U$2.P$62 U$2.P$63 U$2.P$64 U$2.P$65 U$2.P$66 U$2.P$67 U$2.P$68 U$2.Q$1 U$2.Q$2 U$2.Q$3 U$2.Q$4 U$2.Q$5 U$2.Q$6 U$2.Q$7 U$2.Q$8 U$2.Q$9 U$2.Q$10 U$2.Q$11 U$2.Q$12 U$2.Q$13 U$2.Q$14 U$2.Q$15 U$2.Q$16 U$2.Q$17 U$2.Q$18 U$2.Q$19 U$2.Q$20 U$2.Q$21 U$2.Q$22 U$2.Q$23 U$2.Q$24 U$2.Q$25 U$2.Q$26 U$2.Q$27 U$2.Q$28 U$2.Q$29 U$2.Q$30 U$2.Q$31 U$2.Q$32 U$2.Q$33 U$2.Q$34 U$2.Q$35 U$2.Q$36 U$2.Q$37 U$2.Q$38 U$2.Q$39 U$2.Q$40 U$2.Q$41 U$2.Q$42 U$2.Q$43 U$2.Q$44 U$2.Q$45 U$2.Q$46 U$2.Q$47 U$2.Q$48 U$2.Q$49 U$2.Q$50 U$2.Q$51 U$2.Q$52 U$2.Q$53 U$2.Q$54 U$2.Q$55 U$2.Q$56 U$2.Q$57 U$2.Q$58 U$2.Q$59 U$2.Q$60 U$2.Q$61 U$2.Q$62 U$2.Q$63 U$2.Q$64 U$2.Q$65 U$2.Q$66 U$2.Q$67 U$2.Q$68

## Notes on the sheet
- INPUT PROTECTION BIAS VOLTAGE ~4.6V
- Seeed 4 layer stackup:
  1.4 mil trace
  8 mill prepeg
  0.7 mil trace
  XX mil FR4 core
  0.7 mil trace
  8 mil prepeg
  1.4 mil trace
- FMC HEADER
- LVCMOS1.8
- POWER INPUT
- PCI ADD IN CARD
- IMMEDIATE INPUT 
  OVERVOLTAGE PROTECTION
- AQ. BOARD SIDE
- HEADSTAGE SIDE
- ISOLATED TEST POINTS
- SN65LVDT388A has integrated
  110 ohm term resistors.
- UEI15 Choices:
  12V: S24SE12002 w/ Rtrim = Inf
  5.5V: UEI15-050-Q12P-C w/ Rtrm = 9.53k resistor
- Parity error on high-speed forward
  channel and pass will go low. This
  should be provided to LPC connector
- NOTES:
  - ISO7240 Zo for 3.3V is ~100 Ohms.
- Power: ~1.3A DC at 12V; 15.6W. With
  90% efficiency regulation to 5.5V at
  serializer, this translates to 2.55A
  available, which is enough for 1A/LED 
  + 500 mA serializer and FPGA.
- L2 is the smallest package size I could
  find that barely meets current saturation
  requriements. An 8x8mm device that is
  probably safer is the Bourns SRN8040TA
  series.

## Power pins joined to a net without a drawn wire
GND: FMC_LPC.GNDA(GND$1:GND) FMC_LPC.GNDB(GND$2:GND)

## Library data of the parts
C1 C2 C25 = RHD2000_eval_board:C: Capacitor
C3 C13 C20 = jonnew:C: Capacitor; MN: TDK Corp.; PARTNO: C2012X5R1Cxxxxxxx; VID: DK
C4-C12 C14-C19 C21-C24 C26-C40 C42 C45 C49-C61 C80-C86 C88-C98 = jonnew:C: Capacitor
C44 C46-C48 C66 C87 = jonnew:C-POL: Polarized Capacitor
D1-D4 = jonnew:DIODE2
D5 D6 = jonnew:Z-DIODE: Zener Diode
DI1 DI2 DO1 DO2 LINK = jonnew:COAX: COAX CONNECTOR - Edge mount BNC - Vertical BNC - Vertical SMA - etc
F1-F4 = jonnew:FUSE
FMC_LPC = jonnew:FMC_LPC_160_PIN
L1-L6 L7/0R = jonnew:L: Inductor
OUT PWR/LOCK TERM = jonnew:LED_2X
PCIE-PWR = jonnew:PINHD-2X3
Q1-Q5 = jonnew:N-MOSFET: N-CHANNEL MOS FET SYMBOL
R1-R4 R12 R13 R33 R34 R46 R75 = cyclops:R: Resistor; DK: PxxxxHTR-ND; MN: Panasonic; MPN: ERJ-3EKFxxxxV
R5-R10 R20 R26-R29 R31 R32 R55 R56 R59 R64-R74 = jonnew:R: Resistor; DK: PxxxxHTR-ND; MN: Panasonic; MPN: ERJ-3EKFxxxxV
R11 = RHD2000_eval_board:R: Resistor
R14-R19 R21-R25 R30 R35-R45 R47-R54 R57 R58 R60-R63 = jonnew:R: Resistor
TP1-TP29 = jonnew:TP: Test pad
U1 U18 = jonnew:SCREW4: Screw Terminal
U2 U3 = jonnew:JP3E
U4 = jonnew:QUAD-LINE-DRIVER
U5 U6 = jonnew:COMPARITOR
U7 = jonnew:DIPSW-004
U8 = jonnew:MCP47FEBX2
U9 = jonnew:DS90UB914A-Q1
U10 = jonnew:LTM4622
U11 = jonnew:DIGISO-I2C
U12 = jonnew:DC-DC-CONVERTER-ADJ
U13-U16 = jonnew:DIGISO-4-0
U17 = jonnew:DIGISO-2-2
U19 = jonnew:SN65LVDS388A
U20 = jonnew:SN65LVDS387
U21 = jonnew:SN65LVDS391
U$2 = molex_vhdci:MOLEX_DUAL_STACKED_VHDCI
X1 = jonnew:PCI-MECH

## Net classes
1 diff: width 0.229 mm, drill 0.33 mm, clearance 0.127 mm